# EAGLE board CFT-PB0-revB (EAGLE 5.11)
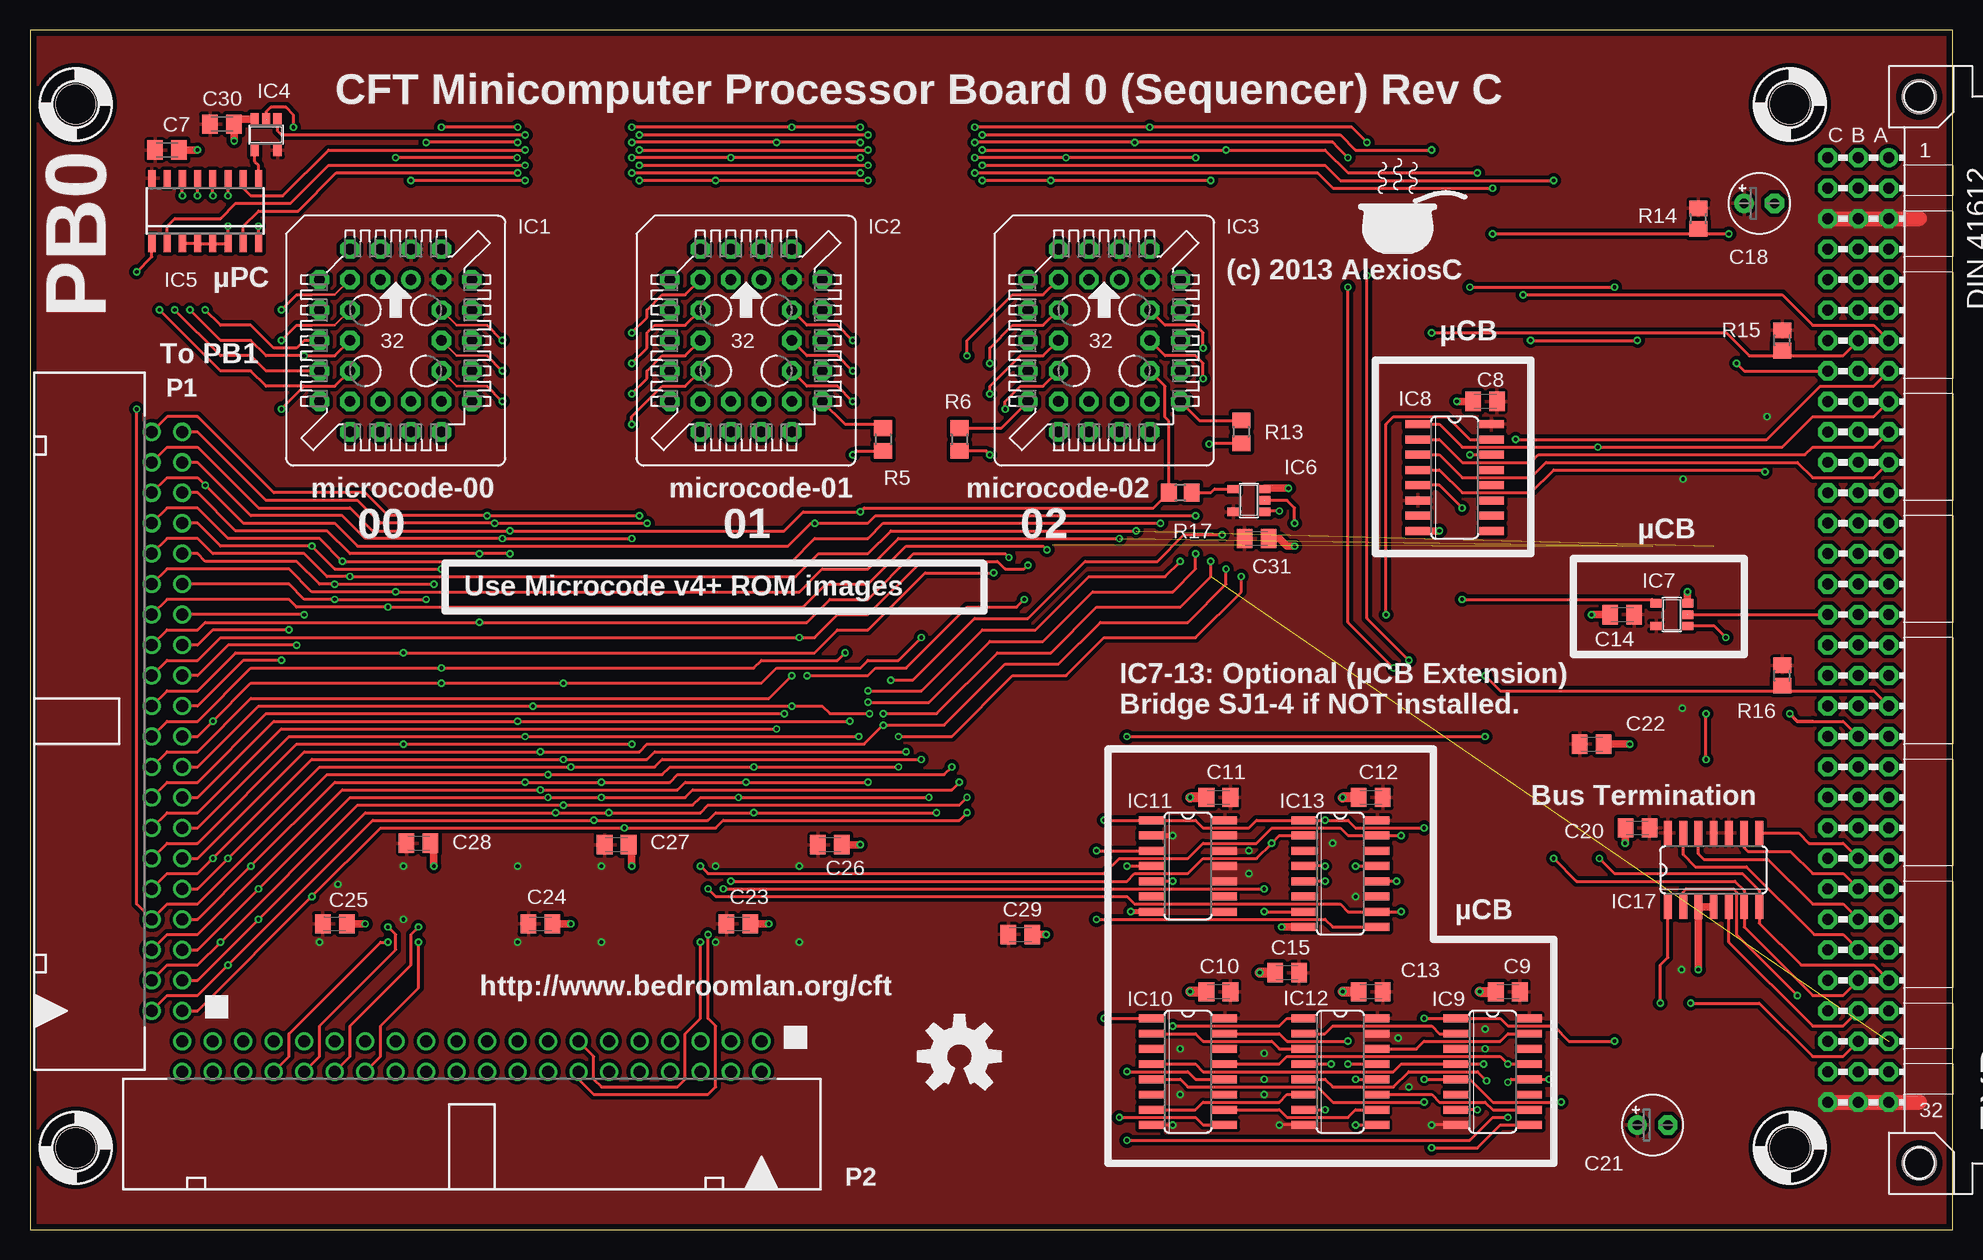
[diagram p4: board, top side]
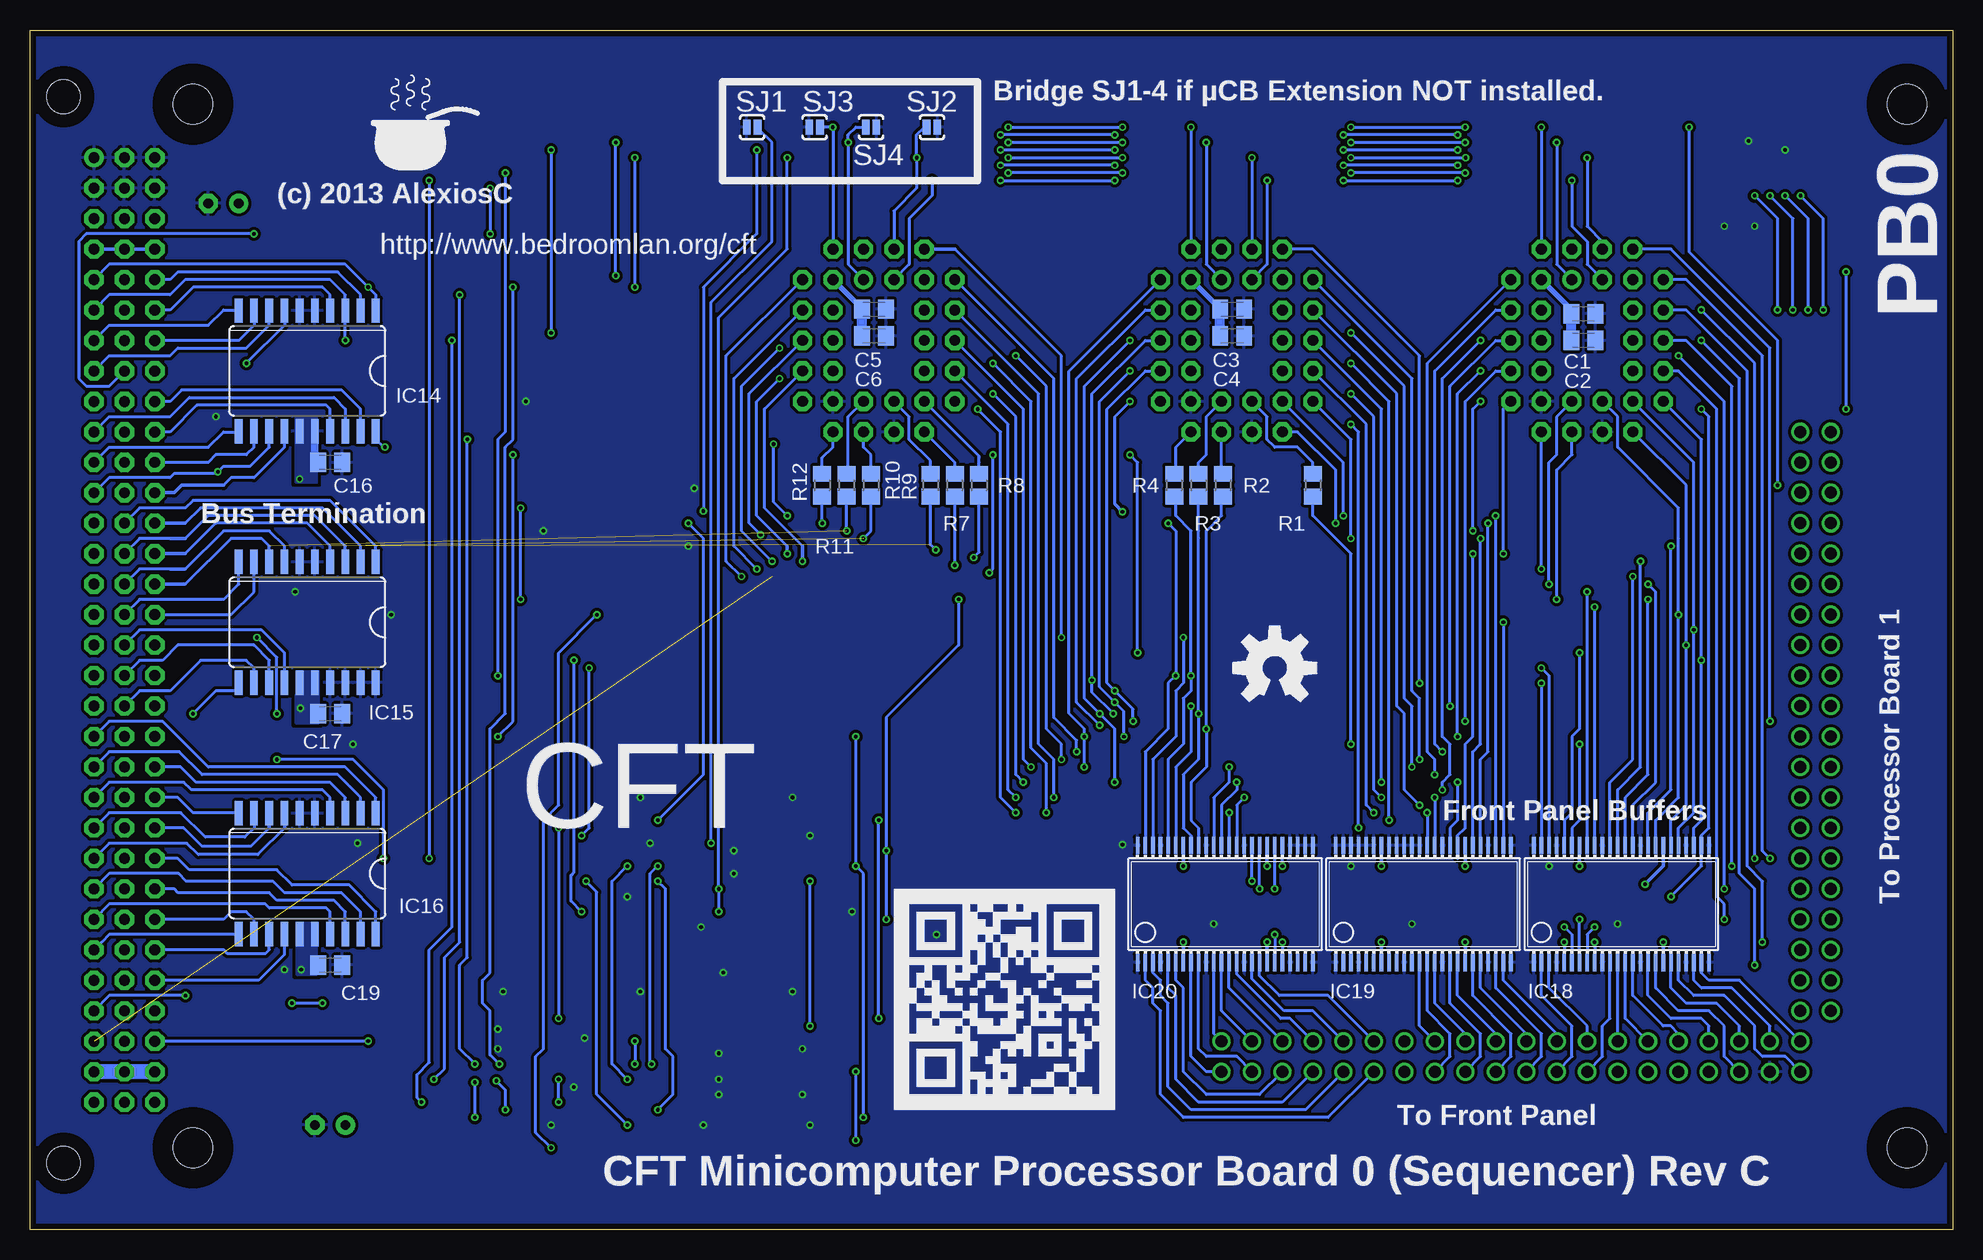
[diagram p5: board, bottom side, seen from below]

Size 160.27 x 100.03 mm. Coordinates in mm from the lower left corner, seen from the top.
Copper layers (1*16): Top 0.035mm / dielectric 1.5mm / Bottom 0.035mm
Design rules "smart-prototyping *": minimum track width 7mil, minimum drill 12mil, track to track 7mil, track to pad 7mil, pad to pad 7mil, via to via 7mil, smd to smd 0mil, copper to edge 20mil, drill to drill 10mil, minimum pad ring 10mil, minimum via ring 6mil, stop-mask expansion 2mil, vias tented up to drill 25mil, thermal gap 10mil
Net classes: 0 default: width 0.203 mm, clearance 0.152 mm; 1 low power: width 0.203 mm, clearance 0.152 mm; 2 LED power: width 1.93 mm, clearance 0.152 mm

## Footprints (pad centres in the part's own frame; a part is rotated, then mirrored left to right if it is on the bottom)
C0805K = smd 1.3 x 1.6: 1 -1,0; 2 1,0
E2,5-5 = drill 0.813 pad 1.6 round: + -1.27,0 | drill 0.813 pad 1.6 octagon: - 1.27,0
VG96K = drill 0.914 pad 1.6 round: A1 154.94,39.37 | drill 0.914 pad 1.6 octagon: A2 154.94,36.83; A3 154.94,34.29; A4 154.94,31.75; A5 154.94,29.21; A6 154.94,26.67; A7 154.94,24.13; A8 154.94,21.59; A9 154.94,19.05; A10 154.94,16.51; A11 154.94,13.97; A12 154.94,11.43; A13 154.94,8.89; A14 154.94,6.35; A15 154.94,3.81; A16 154.94,1.27; A17 154.94,-1.27; A18 154.94,-3.81; A19 154.94,-6.35; A20 154.94,-8.89; A21 154.94,-11.43; A22 154.94,-13.97; A23 154.94,-16.51; A24 154.94,-19.05; A25 154.94,-21.59; A26 154.94,-24.13; A27 154.94,-26.67; A28 154.94,-29.21; A29 154.94,-31.75; A30 154.94,-34.29; A31 154.94,-36.83; A32 154.94,-39.37; B1 152.4,39.37; B2 152.4,36.83; B3 152.4,34.29; B4 152.4,31.75; B5 152.4,29.21; B6 152.4,26.67; B7 152.4,24.13; B8 152.4,21.59; B9 152.4,19.05; B10 152.4,16.51; B11 152.4,13.97; B12 152.4,11.43; B13 152.4,8.89; B14 152.4,6.35; B15 152.4,3.81; B16 152.4,1.27; B17 152.4,-1.27; B18 152.4,-3.81; B19 152.4,-6.35; B20 152.4,-8.89; B21 152.4,-11.43; B22 152.4,-13.97; B23 152.4,-16.51; B24 152.4,-19.05; B25 152.4,-21.59; B26 152.4,-24.13; B27 152.4,-26.67; B28 152.4,-29.21; B29 152.4,-31.75; B30 152.4,-34.29; B31 152.4,-36.83; B32 152.4,-39.37; C1 149.86,39.37; C2 149.86,36.83; C3 149.86,34.29; C4 149.86,31.75; C5 149.86,29.21; C6 149.86,26.67; C7 149.86,24.13; C8 149.86,21.59; C9 149.86,19.05; C10 149.86,16.51; C11 149.86,13.97; C12 149.86,11.43; C13 149.86,8.89; C14 149.86,6.35; C15 149.86,3.81; C16 149.86,1.27; C17 149.86,-1.27; C18 149.86,-3.81; C19 149.86,-6.35; C20 149.86,-8.89; C21 149.86,-11.43; C22 149.86,-13.97; C23 149.86,-16.51; C24 149.86,-19.05; C25 149.86,-21.59; C26 149.86,-24.13; C27 149.86,-26.67; C28 149.86,-29.21; C29 149.86,-31.75; C30 149.86,-34.29; C31 149.86,-36.83; C32 149.86,-39.37 | hole 2.794: 157.48,44.45; 157.48,-44.45
PLCC32 = drill 0.9 pad 1.6 round: 1 1.27,5.08 | drill 0.9 pad 1.6 octagon: 2 -1.27,7.62; 3 -1.27,5.08; 4 -3.81,7.62; 5 -6.35,5.08; 6 -3.81,5.08; 7 -6.35,2.54; 8 -3.81,2.54; 9 -6.35,0; 10 -3.81,0; 11 -6.35,-2.54; 12 -3.81,-2.54; 13 -6.35,-5.08; 14 -3.81,-7.62; 15 -3.81,-5.08; 16 -1.27,-7.62; 17 -1.27,-5.08; 18 1.27,-7.62; 19 1.27,-5.08; 20 3.81,-7.62; 21 6.35,-5.08; 22 3.81,-5.08; 23 6.35,-2.54; 24 3.81,-2.54; 25 6.35,0; 26 3.81,0; 27 6.35,2.54; 28 3.81,2.54; 29 6.35,5.08; 30 3.81,7.62; 31 3.81,5.08; 32 1.27,7.62
SOT23-5 = smd 0.69 x 0.99: 1 -0.95,-1.29; 2 0,-1.29; 3 0.95,-1.29; 4 0.95,1.3; 5 -0.95,1.3
SO16D = smd 0.6 x 1.4: 1 -4.445,-2.715; 2 -3.175,-2.715; 3 -1.905,-2.715; 4 -0.635,-2.715; 5 0.635,-2.715; 6 1.905,-2.715; 7 3.175,-2.715; 8 4.445,-2.715; 9 4.445,2.715; 10 3.175,2.715; 11 1.905,2.715; 12 0.635,2.715; 13 -0.635,2.715; 14 -1.905,2.715; 15 -3.175,2.715; 16 -4.445,2.715
SO16 = smd 0.66 x 2.032: 1 -4.445,-3.073; 2 -3.175,-3.073; 3 -1.905,-3.073; 4 -0.635,-3.073; 5 0.635,-3.073; 6 1.905,-3.073; 7 3.175,-3.073; 8 4.445,-3.073; 9 4.445,3.073; 10 3.175,3.073; 11 1.905,3.073; 12 0.635,3.073; 13 -0.635,3.073; 14 -1.905,3.073; 15 -3.175,3.073; 16 -4.445,3.073
SO14 = smd 0.66 x 2.032: 1 -3.81,-3.073; 2 -2.54,-3.073; 3 -1.27,-3.073; 4 0,-3.073; 5 1.27,-3.073; 6 2.54,-3.073; 7 3.81,-3.073; 8 3.81,3.073; 9 2.54,3.073; 10 1.27,3.073; 11 0,3.073; 12 -1.27,3.073; 13 -2.54,3.073; 14 -3.81,3.073
SO20W = smd 0.66 x 2.032: 1 -5.715,-5.029; 2 -4.445,-5.029; 3 -3.175,-5.029; 4 -1.905,-5.029; 5 -0.635,-5.029; 6 0.635,-5.029; 7 1.905,-5.029; 8 3.175,-5.029; 9 4.445,-5.029; 10 5.715,-5.029; 11 5.715,5.029; 12 4.445,5.029; 13 3.175,5.029; 14 1.905,5.029; 15 0.635,5.029; 16 -0.635,5.029; 17 -1.905,5.029; 18 -3.175,5.029; 19 -4.445,5.029; 20 -5.715,5.029
SSOP48DL = smd 0.305 x 1.422: 1 -6.985,-4.877; 2 -6.35,-4.877; 3 -5.715,-4.877; 4 -5.08,-4.877; 5 -4.445,-4.877; 6 -3.81,-4.877; 7 -3.175,-4.877; 8 -2.54,-4.877; 9 -1.905,-4.877; 10 -1.27,-4.877; 11 -0.635,-4.877; 12 0,-4.877; 13 0.635,-4.877; 14 1.27,-4.877; 15 1.905,-4.877; 16 2.54,-4.877; 17 3.175,-4.877; 18 3.81,-4.877; 19 4.445,-4.877; 20 5.08,-4.877; 21 5.715,-4.877; 22 6.35,-4.877; 23 6.985,-4.877; 24 7.62,-4.877; 25 7.62,4.877; 26 6.985,4.877; 27 6.35,4.877; 28 5.715,4.877; 29 5.08,4.877; 30 4.445,4.877; 31 3.81,4.877; 32 3.175,4.877; 33 2.54,4.877; 34 1.905,4.877; 35 1.27,4.877; 36 0.635,4.877; 37 0,4.877; 38 -0.635,4.877; 39 -1.27,4.877; 40 -1.905,4.877; 41 -2.54,4.877; 42 -3.175,4.877; 43 -3.81,4.877; 44 -4.445,4.877; 45 -5.08,4.877; 46 -5.715,4.877; 47 -6.35,4.877; 48 -6.985,4.877
PAK100/2500-5-40 = drill 1 pad 1.422 round: 1 -24.13,-1.27; 2 -24.13,1.27; 3 -21.59,-1.27; 4 -21.59,1.27; 5 -19.05,-1.27; 6 -19.05,1.27; 7 -16.51,-1.27; 8 -16.51,1.27; 9 -13.97,-1.27; 10 -13.97,1.27; 11 -11.43,-1.27; 12 -11.43,1.27; 13 -8.89,-1.27; 14 -8.89,1.27; 15 -6.35,-1.27; 16 -6.35,1.27; 17 -3.81,-1.27; 18 -3.81,1.27; 19 -1.27,-1.27; 20 -1.27,1.27; 21 1.27,-1.27; 22 1.27,1.27; 23 3.81,-1.27; 24 3.81,1.27; 25 6.35,-1.27; 26 6.35,1.27; 27 8.89,-1.27; 28 8.89,1.27; 29 11.43,-1.27; 30 11.43,1.27; 31 13.97,-1.27; 32 13.97,1.27; 33 16.51,-1.27; 34 16.51,1.27; 35 19.05,-1.27; 36 19.05,1.27; 37 21.59,-1.27; 38 21.59,1.27; 39 24.13,-1.27; 40 24.13,1.27
R0805 = smd 1.3 x 1.5: 1 -0.95,0; 2 0.95,0
R0805' = smd 1.3 x 1.5: 1 -0.85,0; 2 0.85,0
SJ_2S-NO = smd 0.635 x 1.27: 1 -0.45,0; 2 0.45,0
STANDOFF_28_60 = hole 3.302: 0,0

## Placement (x,y rotation side)
$4_37_$  SIGNATURESILK  [SIGNATURE]  131.44,88.11 0 bottom
$4_39_$  OSHW-LOGOL  [OSHW-LOGO-L]  56.52,46.84 0 bottom
$4_40_$  QRCODE-CFT  [CFT-QRCODE]  88.27,10.01 0 bottom
C1  0.1uF  [C0805K]  30.8,76.37 0 bottom
C2  1uF  [C0805K]  30.8,74.14 0 bottom
C3  0.1uF  [C0805K]  60.07,76.75 0 bottom
C4  1uF  [C0805K]  60.07,74.52 0 bottom
C5  0.1uF  [C0805K]  89.92,76.75 0 bottom
C6  1uF  [C0805K]  89.92,74.52 0 bottom
C7  0.1uF  [C0805K]  11.43,90.02 0 top
C8  0.1uF  [C0805K]  121.28,69.06 180 top
C9  0.1uF  [C0805K]  123.19,19.85 180 top
C10  0.1uF  [C0805K]  99.06,19.85 180 top
C11  0.1uF  [C0805K]  99.06,36.04 180 top
C12  0.1uF  [C0805K]  111.76,36.04 180 top
C13  0.1uF  [C0805K]  111.76,19.85 180 top
C14  0.1uF  [C0805K]  132.72,51.28 180 top
C15  1uF  [C0805K]  104.78,21.44 180 top
C16  0.1uF  [C0805K]  135.25,63.98 0 bottom
C17  0.1uF  [C0805K]  135.25,43.03 0 bottom
C18  47uF  [E2,5-5]  144.15,85.57 0 top
C19  0.1uF  [C0805K]  135.25,22.07 0 bottom
C20  0.1uF  [C0805K]  133.99,33.5 180 top
C21  47uF  [E2,5-5]  135.25,8.74 0 top
C22  1uF  [C0805K]  130.18,40.49 0 top
C23  0.1uF  [C0805K]  59.05,25.5 0 top
C24  0.1uF  [C0805K]  42.55,25.5 0 top
C25  0.1uF  [C0805K]  25.4,25.5 0 top
C26  0.1uF  [C0805K]  66.67,32.11 0 top
C27  0.1uF  [C0805K]  48.9,32.11 0 top
C28  0.1uF  [C0805K]  32.38,32.23 0 top
C29  1uF  [C0805K]  82.55,24.61 0 top
C30  0.1uF  [C0805K]  16,92.18 0 top
C31  0.1uF  [C0805K]  102.23,57.63 0 top
EXP  [VG96K]  0,50.01 0 top
IC1  29F040  [PLCC32]  30.48,74.14 0 top
IC2  29F040  [PLCC32]  59.69,74.14 0 top
IC3  29F040  [PLCC32]  89.53,74.14 0 top
IC4  74AHC1G08DBV  [SOT23-5]  19.68,91.29 180 top
IC5  74HC161D  [SO16D]  14.61,84.94 0 top
IC6  74AHC1G00DBV  [SOT23-5]  101.6,60.81 90 top
IC7  74AHC1G32DBV  [SOT23-5]  136.84,51.28 90 top
IC8  74HC138D  [SO16]  118.75,62.71 270 top
IC9  74HC175D  [SO16]  121.92,13.18 270 top
IC10  74HC175D  [SO16]  96.52,13.18 270 top
IC11  74HC74D  [SO14]  96.52,30.33 270 top
IC12  74HC157D  [SO16]  109.22,13.18 270 top
IC13  74HC175D  [SO16]  109.22,29.69 270 top
IC14  SN74ACT1073  [SO20W]  137.16,71.6 180 bottom
IC15  SN74ACT1073  [SO20W]  137.16,50.65 180 bottom
IC16  SN74ACT1073  [SO20W]  137.16,29.69 180 bottom
IC17  SN74ACT1071D  [SO14]  140.34,30.01 0 top
IC18  74AC16244DL  [SSOP48DL]  27.94,27.15 0 bottom
IC19  74AC16244DL  [SSOP48DL]  44.45,27.15 0 bottom
IC20  74AC16244DL  [SSOP48DL]  60.96,27.15 0 bottom
P1  2540-5  [PAK100/2500-5-40]  11.43,42.39 90 top
P2  2540-5  [PAK100/2500-5-40]  36.83,14.45 180 top
R1  30R  [R0805]  53.34,62.08 270 bottom
R2  30R  [R0805]  60.83,62.08 270 bottom
R3  30R  [R0805]  62.87,62.08 270 bottom
R4  30R  [R0805]  64.9,62.08 270 bottom
R5  30R  [R0805]  71.12,65.89 270 top
R6  30R  [R0805]  77.47,65.89 270 top
R7  30R  [R0805]  83.19,62.08 270 bottom
R8  30R  [R0805]  81.15,62.08 270 bottom
R9  30R  [R0805]  85.22,62.08 270 bottom
R10  30R  [R0805]  90.17,62.08 270 bottom
R11  30R  [R0805]  92.2,62.08 270 bottom
R12  30R  [R0805]  94.23,62.08 270 bottom
R13  30R  [R0805]  100.97,66.52 270 top
R14  4k7  [R0805']  139.06,84.3 90 top
R15  4k7  [R0805']  146.05,74.14 90 top
R16  4k7  [R0805']  146.05,46.2 90 top
R17  30R  [R0805]  95.89,61.44 180 top
SJ1  SOLDERJUMPER-OLDNO  [SJ_2S-NO]  100.08,91.92 0 bottom
SJ2  SOLDERJUMPER-OLDNO  [SJ_2S-NO]  85.09,91.92 180 bottom
SJ3  SOLDERJUMPER-OLDNO  [SJ_2S-NO]  94.87,91.92 0 bottom
SJ4  SOLDERJUMPER-OLDNO  [SJ_2S-NO]  90.17,91.92 180 bottom
U1  HOLE  [STANDOFF_28_60]  3.81,93.83 0 top
U2  HOLE  [STANDOFF_28_60]  3.81,6.83 0 top
U3  HOLE  [STANDOFF_28_60]  146.69,93.83 0 top
U4  HOLE  [STANDOFF_28_60]  146.69,6.83 0 top
U$1  SIGNATURESILK  [SIGNATURE]  111.12,81.13 0 top
U$3  OSHW-LOGOL  [OSHW-LOGO-L]  77.47,14.45 0 top

## Tracks (layer width: path | path; a pad name or v marks a point on that pad's centre or on a via)
!AINDEX  (via drill 0.3)
  Top 0.203: 23.5,75.41 25.4,75.41 IC1.8
  Top 0.254: v20.95,74.14 22.23,75.41 23.5,75.41 | P1.2 11.43,19.53 13.97,19.53 v16.51,22.07 28.57,34.14 v46.99,34.14 56.52,34.14 57.15,34.77 v60.33,34.77 v75.56,34.77 | IC2.8 54.61,75.41 52.07,75.41 51.44,74.78 51.44,73.51 v50.16,72.24 | IC3.8 84.45,75.41 81.92,75.41 80.01,73.51 v80.01,72.24
  Bottom 0.254: v50.16,72.24 46.99,69.06 v46.99,34.14 | v16.51,22.07 16.51,28.42 17.78,29.69 17.78,70.97 v20.95,74.14 | v80.01,72.24 76.83,69.06 76.83,40.17 75.56,38.9 v75.56,34.77 | v60.33,34.77 IC20.36
!CLI  (via drill 0.3)
  Top 0.254: P1.18 11.43,39.85 13.97,39.85 18.41,44.3 61.59,44.3 v63.5,46.2
  Bottom 0.254: IC20.44 65.41,39.22 64.14,40.49 64.14,44.3 63.5,44.93 v63.5,46.2 63.5,58.27 64.77,59.54 64.77,61 R4.2
!CLL  (via drill 0.3)
  Top 0.254: P1.14 11.43,34.77 13.97,34.77 20.95,41.76 v62.23,41.76
  Bottom 0.254: IC20.40 62.87,33.5 63.5,34.14 63.5,37.31 62.23,38.58 v62.23,41.76 62.23,58.27 60.96,59.54 60.96,61 R2.2
!CPL  (via drill 0.3)
  Top 0.254: P1.12 11.43,32.23 13.97,32.23 22.23,40.49 v31.11,40.49 v50.16,40.49
  Bottom 0.254: v50.16,40.49 50.16,56.36 53.34,59.54 R1.2 | v31.11,40.49 31.11,34.14 31.75,33.5 IC18.43
!DEC  (via drill 0.3)
  Top 0.254: v81.6,56.04 81.28,56.36 73.66,56.36 69.85,52.55 66.67,52.55 64.77,50.65 v37.47,50.65 14.61,50.65 13.97,50.01 11.43,50.01 P1.26
  Bottom 0.254: v37.47,50.65 IC19.26 | R8.2 81.15,56.49 v81.6,56.04
!END  (via drill 0.3)
  Top 0.254: v97.16,59.54 70.48,59.54 69.85,58.9 v65.41,58.9 65.09,58.9 63.18,57 27.3,57 25.4,58.9 17.78,58.9 v14.61,62.08 13.97,62.71 11.43,62.71 P1.36 | v82.87,52.55 82.23,51.92 78.11,51.92 73.03,46.84 70.48,46.84 69.85,46.2 v64.77,46.2 | IC13.9 108.58,25.25 107.95,25.88 v88.9,25.88 | v88.9,31.6 IC11.3 | R13.2 98.36,65.57 v98.3,65.51 | v21.97,91.92 21.97,92.94 21.34,93.57 20.07,93.57 19.68,93.19 IC4.2
  Bottom 0.254: v65.41,58.9 64.77,58.27 v64.77,46.2 65.41,45.57 65.41,41.76 67.31,39.85 IC20.47 | v82.87,52.55 82.87,48.74 88.9,42.71 v88.9,31.6 v88.9,25.88 | v98.3,65.51 98.3,60.68 v97.16,59.54 | v14.61,62.08 14.61,74.14 21.97,81.51 v21.97,91.92
!ENDEXT  (via drill 0.3)
  Top 0.254: v116.84,90.02 110.49,90.02 109.22,91.29 v79.38,91.29 | v116.84,74.78 141.39,74.78 143.29,72.87 146.05,72.87 R15.1 146.47,72.87 151.13,72.87 EXP.B7 | v50.8,91.29 v69.85,91.29 | v41.27,91.29 20.95,91.29 20.64,91.61 IC4.1
  Bottom 0.254: v116.84,90.02 v116.84,74.78 | v69.85,91.29 v79.38,91.29 | v41.27,91.29 v50.8,91.29
!HALT  (via drill 0.3)
  Top 0.254: EXP.A19 153.67,44.93 146.47,44.93 R16.1 arc-90 145.63,44.93 122.56,44.93 v121.28,46.2 | v120.65,88.11 109.86,88.11 107.95,90.02 v99.69,90.02 v79.38,90.02 | v50.8,90.02 v69.85,90.02 | v41.27,90.02 24.89,90.02 21.08,86.21 18.41,86.21 17.78,86.84 IC5.10 | IC6.1 102.95,59.92 v104.14,59.92
  Bottom 0.254: v120.65,88.11 120.65,66.52 121.28,65.89 v121.28,46.2 | v99.69,90.02 99.69,83.03 104.14,78.59 v104.14,59.92 | v69.85,90.02 v79.38,90.02 | v41.27,90.02 v50.8,90.02
!INCPC  (via drill 0.3)
  Top 0.254: P1.20 11.43,42.39 13.97,42.39 18.41,46.84 v34.29,46.84 60.33,46.84 60.96,47.47 67.31,47.47 v67.94,48.11 | R5.2 68.9,64.94 v68.58,64.62
  Bottom 0.254: v34.29,46.84 33.66,46.2 IC18.46 | v67.94,48.11 67.94,63.98 v68.58,64.62
!IO  (via drill 0.3)  (1 unrouted)
  Top 0.254: v90.81,57.63 72.39,57.63 69.85,55.09 66.04,55.09 64.14,53.19 v30.48,53.19 23.5,53.19 21.59,55.09 11.43,55.09 P1.30
  Bottom 0.254: 147.32,56.36 144.78,58.9 137.16,58.9 135.25,57 IC15.4 | IC18.41 v30.48,53.19 | R10.2 90.17,58.27 v90.81,57.63
  Bottom 0.305: 147.32,56.36 EXP.C14
!IODEV1XX
  Top 0.254: EXP.B24 151.13,32.23 148.27,32.23 147.42,33.08 IC17.8
!IODEV2XX
  Top 0.254: EXP.B25 151.13,29.69 148.59,29.69 146.75,31.53 143.19,31.53 142.88,31.85 IC17.9
!IODEV3XX
  Top 0.254: EXP.B26 151.13,27.15 148.59,27.15 144.84,30.9 139.51,30.9 139.06,31.34 IC17.12
!IRQS  (via drill 0.3)  (1 unrouted)
  Top 0.203: 38.1,75.41 35.56,75.41 IC1.28
  Top 0.254: v39.37,74.14 38.1,75.41 | v98.42,55.73 98.42,54.46 95.89,51.92 88.9,51.92 85.09,48.11 80.64,48.11 75.56,43.03 v71.12,43.03 | P1.6 11.43,24.61 13.97,24.61 26.04,36.68 v42.55,36.68 53.98,36.68 54.61,37.31 v59.69,37.31 v69.85,37.31 | IC2.28 64.77,75.41 67.31,75.41 v68.58,74.14 | IC3.28 94.61,75.41 97.16,75.41 97.79,74.78 v97.79,73.51
  Bottom 0.254: v97.79,73.51 100.97,70.33 100.97,58.27 v98.42,55.73 | v39.37,74.14 42.55,70.97 42.55,41.12 41.91,40.49 41.91,37.95 42.55,37.31 v42.55,36.68 | v68.58,74.14 72.39,70.33 72.39,44.3 v71.12,43.03 69.85,41.76 v69.85,37.31 | v59.69,37.31 59.69,36.68 60.96,35.41 IC20.37
!MEM  (via drill 0.3)  (1 unrouted)
  Top 0.254: v84.77,56.68 84.45,57 73.03,57 69.85,53.82 66.36,53.82 64.45,51.92 v29.84,51.92 22.23,51.92 21.59,52.55 11.43,52.55 P1.28
  Bottom 0.254: 147.32,58.9 146.05,60.17 135.89,60.17 132.72,57 IC15.2 | IC18.40 v29.84,51.92 | R9.2 85.22,57.12 v84.77,56.68
  Bottom 0.305: 147.32,58.9 EXP.C13
!R  (via drill 0.3)  (1 unrouted)
  Top 0.254: v92.2,58.27 71.75,58.27 69.85,56.36 65.72,56.36 63.82,54.46 v26.67,54.46 24.77,54.46 22.86,56.36 15.24,56.36 13.97,57.63 11.43,57.63 P1.32
  Bottom 0.254: 147.32,53.82 143.51,57.63 140.97,57.63 140.34,57 IC15.8 | IC18.38 28.57,37.31 26.67,39.22 v26.67,54.46 | v92.2,58.27 R11.2
  Bottom 0.305: 147.32,53.82 EXP.C15
!RESET  (via drill 0.3)
  Top 0.254: v89.53,17.63 IC10.1 | v89.53,34.14 IC11.1 97.16,34.14 97.79,33.5 101.6,33.5 102.23,34.14 IC13.1 v107.95,34.14 109.86,34.14 110.49,33.5 v116.2,33.5 | v116.2,17.63 IC9.1 122.56,17.63 123.19,16.99 127,16.99 128.27,15.72 v132.08,15.72 | IC6.2 104.78,60.81 105.41,60.17 v105.41,58.9
  Bottom 0.254: v89.53,17.63 v89.53,34.14 | v116.2,33.5 v116.2,17.63 | v105.41,58.9 104.14,57.63 104.14,37.95 v107.95,34.14 | v132.08,15.72 EXP.C30
!RSTHOLD  (via drill 0.3)
  Top 0.254: v100.97,54.46 100.97,53.19 97.16,49.38 89.53,49.38 86.36,46.2 81.92,46.2 76.83,41.12 v72.39,41.12 | v72.39,38.58 v60.33,38.58 53.34,38.58 52.7,37.95 v43.18,37.95 24.77,37.95 13.97,27.15 11.43,27.15 P1.8 8.89,27.15 v8.89,68.43 | v8.89,79.86 10.16,81.13 IC5.1
  Bottom 0.254: IC3.29 102.23,72.87 102.23,55.73 v100.97,54.46 | IC1.29 43.81,72.24 43.81,39.85 43.18,39.22 v43.18,37.95 | IC2.29 73.66,71.6 73.66,43.03 72.39,41.76 v72.39,41.12 v72.39,38.58 | IC20.38 61.59,36.04 60.33,37.31 v60.33,38.58 | v8.89,68.43 v8.89,79.86
!SETUCBP  (via drill 0.3)
  Top 0.254: v116.84,6.83 120.65,6.83 122.56,8.74 IC9.9 | IC8.15 120.02,65.89 118.11,67.79 113.67,67.79 113.03,67.16 v113.03,51.28
  Bottom 0.254: v116.84,6.83 118.11,8.1 118.11,14.45 117.47,15.09 117.47,34.14 116.2,35.41 116.2,48.11 v113.03,51.28
!SETUCBT  (via drill 0.3)
  Top 0.254: IC10.9 97.79,8.74 97.16,9.37 v90.81,9.37 | v91.44,30.33 IC11.4 | v91.44,41.12 v121.28,41.12 | v120.02,64.62 IC8.14
  Bottom 0.254: v90.81,9.37 90.81,29.69 v91.44,30.33 v91.44,41.12 | v121.28,41.12 120.02,42.39 v120.02,64.62
!SKIP  (via drill 0.3)
  Top 0.254: P1.4 11.43,22.07 13.97,22.07 v15.88,23.98 27.3,35.41 v44.45,35.41 55.24,35.41 55.88,36.04 v59.05,36.04 v74.93,36.04
  Bottom 0.254: v15.88,23.98 15.88,29.06 17.14,30.33 17.14,71.6 22.23,76.68 IC1.7 | IC2.7 46.35,69.7 46.35,43.66 45.72,43.03 45.72,36.68 v44.45,35.41 | IC3.7 76.2,69.7 76.2,40.49 74.93,39.22 v74.93,36.04 | v59.05,36.04 59.69,35.41 IC20.35
!STI  (via drill 0.3)
  Top 0.254: P1.16 11.43,37.31 13.97,37.31 19.68,43.03 v62.87,43.03
  Bottom 0.254: IC20.41 63.5,32.87 64.14,33.5 64.14,37.95 62.87,39.22 v62.87,43.03 62.87,57.63 62.87,58.27 R3.2
!STPAC  (via drill 0.3)
  Top 0.254: v83.19,55.41 82.87,55.09 81.28,55.09 80.64,55.73 74.3,55.73 69.85,51.28 67.31,51.28 65.41,49.38 v64.14,49.38 15.88,49.38 13.97,47.47 11.43,47.47 P1.24
  Bottom 0.254: v64.14,49.38 64.14,45.57 64.77,44.93 64.77,41.12 66.67,39.22 IC20.46 | v83.19,55.41 R7.2
!STPDR  (via drill 0.3)
  Top 0.254: v80.33,54.77 74.61,54.77 69.85,50.01 67.31,50.01 65.41,48.11 v31.11,48.11 17.14,48.11 13.97,44.93 11.43,44.93 P1.22 | R6.2 79.69,64.94 v80.01,64.62
  Bottom 0.254: v80.01,64.62 80.01,55.09 v80.33,54.77 | v31.11,48.11 31.11,41.76 31.75,41.12 31.75,34.77 32.38,34.14 IC18.44
!SYSDEV  (via drill 0.3)
  Top 0.254: EXP.A28 153.67,22.07 147.64,22.07 144.15,25.56 IC17.7 144.15,28.3 142.75,29.69 132.08,29.69 v130.81,30.96 | IC7.1 140.4,50.33 v141.35,49.38 | v139.7,39.22 v139.7,43.03
  Bottom 0.254: v130.81,30.96 130.81,36.68 133.35,39.22 v139.7,39.22 | v141.35,49.38 139.7,47.73 v139.7,43.03
!T34
  Top 0.254: EXP.B27 151.13,24.61 148.72,24.61 143.06,30.26 138.81,30.26 137.79,31.28 IC17.13
!UCBA!/UCBB  (via drill 0.3)
  Top 0.254: IC12.1 104.78,17.63 104.14,16.99 v95.25,16.99 | v95.25,29.06 IC11.5
  Bottom 0.254: v95.25,16.99 v95.25,29.06
!UCE  (via drill 0.3)
  Top 0.203: 38.1,70.33 35.56,70.33 IC1.24
  Top 0.254: v39.37,69.06 38.1,70.33 | IC2.24 64.77,70.33 67.31,70.33 v68.58,69.06 | IC3.24 94.61,70.33 94.61,67.73 94.94,67.41 R17.2 93.67,60.17 69.53,60.17 v69.22,59.86 64.45,59.86 62.87,58.27 v40.01,58.27 28.57,58.27 26.67,60.17 19.05,60.17 13.97,65.25 11.43,65.25 P1.38
  Bottom 0.254: v68.58,69.06 69.85,67.79 69.85,60.49 | v39.37,69.06 40.01,68.43 v40.01,58.27
  Bottom 0.305: v69.22,59.86 69.85,60.49
!UPCCLR
  Top 0.254: IC4.4 18.73,89.06 19.05,88.75 IC5.9
!W
  Top 0.254: IC7.2 EXP.C16
  Bottom 0.254: EXP.C16 143.51,51.28 141.6,53.19 IC15.9
!WEN  (via drill 0.3)
  Top 0.254: v94.23,58.9 71.12,58.9 69.85,57.63 65.41,57.63 63.5,55.73 v26.04,55.73 24.13,57.63 16.51,57.63 13.97,60.17 11.43,60.17 P1.34
  Bottom 0.254: IC18.37 27.94,36.68 26.04,38.58 v26.04,55.73 | v94.23,58.9 R12.2
!WS  (via drill 0.3)
  Top 0.254: IC5.7 17.78,83.67 19.05,84.94 22.35,84.94 25.53,88.11 v40.64,88.11 | v141.6,83.03 139.49,83.03 R14.1 138.65,83.03 v121.92,83.03 | v50.16,88.11 v69.22,88.11 | v78.74,88.11 107.31,88.11 108.58,86.84 v121.92,86.84
  Bottom 0.254: EXP.B8 153.67,70.33 155.57,70.33 156.21,70.97 156.21,82.4 155.57,83.03 v141.6,83.03 | v40.64,88.11 v50.16,88.11 | v69.22,88.11 v78.74,88.11 | v121.92,86.84 v121.92,83.03
+3.3V
  Bottom 0.305: EXP.C4 EXP.B4 EXP.A4
+12V
  Bottom 1.27: EXP.C31 EXP.B31 EXP.A31
AB0  (via drill 0.3)
  Top 0.254: IC10.4 97.16,13.82 97.79,13.18 113.67,13.18 114.3,13.82 IC9.4 v121.16,13.82 | v120.02,78.59 v132.08,78.59
  Bottom 0.254: EXP.A5 153.67,80.49 133.99,80.49 v132.08,78.59 131.44,77.95 IC14.1 | v121.16,13.82 121.92,14.58 121.92,18.26 122.56,18.9 122.56,20.8 121.92,21.44 121.92,41.76 120.65,43.03 120.65,65.25 120.02,65.89 v120.02,78.59
AB1  (via drill 0.3)
  Top 0.254: IC10.5 95.89,12.55 96.52,11.91 107.31,11.91 108.58,10.64 v116.2,10.64 | v116.2,12.55 IC9.5 120.02,12.55 121.92,10.64 v127.64,10.64 | v125.09,74.14 v133.99,74.14
  Bottom 0.254: EXP.A6 153.67,77.95 148.59,77.95 147.32,79.22 135.25,79.22 133.99,77.95 IC14.3 v133.99,74.14 | v116.2,10.64 v116.2,12.55 | v125.09,74.14 125.09,25.25 127,23.34 127,13.94 128.02,12.93 128.02,11.02 v127.64,10.64
AB2  (via drill 0.3)
  Top 0.254: IC10.12 97.16,12.55 96.52,13.18 v91.44,13.18 | v91.44,7.47 120.02,7.47 121.92,9.37 v123.19,9.37 | v123.19,12.29 123.44,12.55 IC9.12 v126.62,12.55 | EXP.A7 153.67,75.41 148.59,75.41 146.05,77.95 v124.46,77.95
  Bottom 0.254: v91.44,7.47 v91.44,13.18 | v123.19,9.37 v123.19,12.29 | EXP.A7 153.67,75.41 145.41,75.41 144.15,76.68 142.93,76.68 IC14.10 | v124.46,77.95 124.46,23.98 125.73,22.71 125.73,13.44 v126.62,12.55
AB3  (via drill 0.3)
  Top 0.254: IC10.13 104.14,13.82 104.78,14.45 122.56,14.45 v123.19,13.82 IC9.13 | v123.83,65.89 144.78,65.89 149.22,70.33 153.67,70.33 EXP.A8
  Bottom 0.254: EXP.A8 153.67,72.87 148.59,72.87 147.96,73.51 142.24,73.51 140.34,75.41 IC14.8 | v123.19,13.82 124.46,15.09 124.46,22.07 123.83,22.71 v123.83,65.89
AB4  (via drill 0.3)
  Top 0.254: IC8.1 117.47,67.16 119.38,65.25 v130.68,65.25 146.05,65.25 148.59,67.79 153.67,67.79 EXP.A9
  Bottom 0.254: IC14.20 131.44,65.89 130.81,65.25 v130.68,65.25
AB5
  Top 0.254: IC8.2 117.47,65.89 119.38,63.98 125.09,63.98 125.73,64.62 147.96,64.62 148.59,65.25 153.67,65.25 EXP.A10
  Bottom 0.254: EXP.A10 153.67,67.79 148.59,67.79 147,69.38 134.94,69.38 133.99,68.43 IC14.18
AB6
  Top 0.254: IC8.3 117.47,64.62 119.38,62.71 125.09,62.71 126.36,63.98 147.32,63.98 148.59,62.71 153.67,62.71 EXP.A11
  Bottom 0.203: EXP.A11 154.31,64.62
  Bottom 0.254: 154.31,64.62 153.67,65.25 145.41,65.25 144.15,66.52 142.93,66.52
  Bottom 0.305: 142.93,66.52 IC14.11
AB7  (via drill 0.3)
  Top 0.254: IC8.4 117.47,63.35 119.38,61.44 125.09,61.44 127,63.35 144.46,63.35 v144.62,63.19
  Bottom 0.254: EXP.A12 153.67,62.71 148.59,62.71 148.27,63.03 144.78,63.03 v144.62,63.19 144.15,63.66 141.92,63.66 140.34,65.25 IC14.13
AB8
  Bottom 0.254: EXP.A20 153.67,42.39 149.22,42.39 145.41,38.58 133.99,38.58 131.44,36.04 IC16.1
AB9
  Bottom 0.254: EXP.A21 153.67,39.85 147.83,39.85 145.92,37.95 134.62,37.95 132.72,36.04 IC16.2
AB10
  Bottom 0.254: EXP.A22 153.67,37.31 147.45,37.31 146.81,36.68 135.89,36.68 135.25,36.04 IC16.4
AB11
  Bottom 0.254: EXP.A23 153.67,34.77 147.7,34.77 145.67,32.74 142.37,32.74 141.6,33.5 IC16.9
AB12
  Bottom 0.254: EXP.A24 153.67,32.23 147.19,32.23 146.24,31.28 141.29,31.28 139.06,33.5
  Bottom 0.305: IC16.7 139.06,33.5
AB13
  Bottom 0.254: IC16.19 132.72,26.52 134.3,28.1 139.06,28.1 140.02,29.06 147.26,29.06 147.89,29.69 153.67,29.69 EXP.A25
AB14
  Bottom 0.254: EXP.A26 153.67,27.15 140.65,27.15 140.34,26.83 135.57,26.83 135.25,26.52 IC16.17
AB15
  Bottom 0.203: 154.31,23.98 EXP.A27
  Bottom 0.254: 154.31,23.98 153.67,24.61 142.93,24.61 IC16.11
AEXT0
  Bottom 0.254: EXP.B13 151.13,60.17 148.59,60.17 147.32,60.17 146.69,60.81 135.25,60.81 131.44,57 IC15.1
AEXT1
  Bottom 0.254: 148.59,57.63 151.13,57.63 EXP.B14 | 147.32,57.63 145.41,59.54 136.53,59.54 133.99,57 IC15.3
  Bottom 0.305: 147.32,57.63 148.59,57.63
AEXT2
  Bottom 0.254: 148.59,55.09 151.13,55.09 EXP.B15 | 147.32,55.09 144.15,58.27 140.34,58.27 139.06,57 IC15.7
  Bottom 0.305: 147.32,55.09 148.59,55.09
AEXT3
  Bottom 0.254: EXP.B16 151.13,52.55 148.59,52.55 144.15,52.55 142.88,53.82 IC15.10
AEXT4
  Bottom 0.254: EXP.B17 151.13,50.01 148.59,50.01 140.97,50.01 139.06,48.11 IC15.14
AEXT5
  Bottom 0.254: EXP.B18 151.13,47.47 149.22,47.47 147.96,48.74 141.6,48.74 140.34,47.47 IC15.13
AEXT6
  Bottom 0.254: EXP.B19 151.13,44.93 148.91,44.93 148.59,44.93 146.05,47.47 142.24,47.47 141.6,46.84 IC15.12
AEXT7  (via drill 0.3)
  Top 0.254: EXP.B20 151.13,42.39 148.59,42.39
  Top 0.305: v146.69,43.03 147.32,42.39 148.59,42.39
  Bottom 0.254: v146.69,43.03 144.78,44.93 142.88,44.93
  Bottom 0.305: IC15.11 142.88,44.93
CLK1  (via drill 0.3)
  Top 0.254: IC17.2 137.79,28.17 138.05,28.42 141.99,28.42 142.24,28.17 142.24,24.61 v147.32,19.53
  Bottom 0.254: v147.32,19.53 153.67,19.53 EXP.A29
CLK2
  Top 0.254: IC17.5 141.6,23.98 148.59,16.99 151.13,16.99 EXP.B29
CLK3  (via drill 0.3)
  Top 0.254: v135.89,18.9 135.89,22.07 136.53,22.71 IC17.1 | EXP.B30 151.13,14.45 148.59,14.45 144.15,18.9 v138.43,18.9
  Bottom 0.254: v135.89,18.9 v138.43,18.9
CLK4  (via drill 0.3)
  Top 0.254: EXP.B28 151.13,19.53 148.59,19.53 142.88,25.25 IC17.6 142.88,28.3 142.11,29.06 128.91,29.06 v127,30.96 | v79.38,88.75 107.95,88.75 109.22,87.48 v127,87.48 | v50.8,88.75 v69.85,88.75 | IC5.2 11.43,83.67 12.06,84.3 15.88,84.3 17.14,85.57 21.72,85.57 24.89,88.75 v41.27,88.75
  Bottom 0.254: v69.85,88.75 v79.38,88.75 | v41.27,88.75 v50.8,88.75 | v127,87.48 v127,30.96
DB0
  Bottom 0.254: EXP.C5 148.59,79.22 147.96,79.86 134.62,79.86 132.72,77.95 IC14.2
DB1
  Bottom 0.254: EXP.C6 148.59,76.68 146.69,78.59 135.89,78.59 135.25,77.95 IC14.4
DB2
  Bottom 0.254: EXP.C7 142.88,74.14 141.6,75.41 IC14.9
DB3  (via drill 0.3)
  Top 0.254: v142.24,72.24 142.88,71.6 EXP.C8
  Bottom 0.254: v142.24,72.24 139.06,75.41 IC14.7
DB4
  Bottom 0.254: IC14.19 132.72,68.43 134.3,70.01 147.64,70.01 148.59,69.06 EXP.C9
DB5
  Bottom 0.254: EXP.C10 148.59,66.52 146.37,68.75 135.57,68.75 135.25,68.43 IC14.17
DB6
  Bottom 0.254: EXP.C11 145.41,63.98 144.78,64.62 142.24,64.62 141.6,65.25 IC14.12
DB7
  Bottom 0.254: 144.15,62.08 143.51,62.71 141.6,62.71 139.06,65.25 IC14.14
  Bottom 0.305: 144.15,62.08 147.64,62.08 148.27,61.44 EXP.C12
DB8
  Bottom 0.254: EXP.C21 147.7,38.58 146.43,37.31 135.25,37.31 133.99,36.04 IC16.3
DB9
  Bottom 0.254: EXP.C22 147.96,36.04 146.69,34.77 142.93,34.77 IC16.10
DB10
  Bottom 0.254: EXP.C23 147.45,33.5 145.92,31.98 141.86,31.98 140.34,33.5
  Bottom 0.305: 140.34,33.5 IC16.8
DB11
  Bottom 0.254: EXP.C24 147.96,30.96 147,30.01 139.7,30.01 138.43,28.74 133.67,28.74 131.44,26.52 IC16.20
DB12
  Bottom 0.254: EXP.C25 148.27,28.42 147.96,28.1 140.34,28.1 139.7,27.47 134.94,27.47 133.99,26.52 IC16.18
DB13
  Bottom 0.254: EXP.C26 144.15,25.88 143.51,26.52 142.24,26.52 141.6,25.88 IC16.12
DB14
  Bottom 0.254: EXP.C27 144.15,23.34 143.83,23.03 140.65,23.03 140.34,23.34 IC16.13
DB15
  Bottom 0.254: IC16.14 139.06,22.96 141.22,20.8 EXP.C28
FL  (via drill 0.3)
  Top 0.254: v99.38,57.95 96.2,57.95 93.98,55.73 87.95,55.73 83.19,50.97 78.74,50.97 73.6,45.82 v71.75,45.82 | P1.17 13.97,38.58 19.05,43.66 v41.91,43.66 v63.5,43.66 66.04,43.66 66.67,43.03 v69.98,43.03
  Bottom 0.254: IC3.25 100.33,69.7 100.33,58.9 v99.38,57.95 | IC1.25 38.1,74.14 41.91,70.33 v41.91,43.66 | IC2.25 67.31,74.14 71.75,69.7 v71.75,45.82 71.75,44.81 v69.98,43.03 | v63.5,43.66 63.5,39.85 64.77,38.58 IC20.43
FV  (via drill 0.3)
  Top 0.254: P1.19 13.97,41.12 v15.24,42.39 18.41,45.57 v34.29,45.57 v44.45,45.57 60.96,45.57 62.23,46.84 69.22,46.84 69.85,47.47 72.39,47.47 v74.3,49.38
  Bottom 0.254: v74.3,49.38 74.3,72.87 83.19,81.76 | IC2.4 53.34,81.76 44.45,72.87 v44.45,45.57 | IC1.4 23.5,81.76 15.24,73.51 v15.24,42.39 | v34.29,45.57 IC18.47
  Bottom 0.305: 83.19,81.76 IC3.4
GND  (via drill 0.3)
  Top 0.254: v104.33,25.25 104.33,25.18 | IC10.8 v95.25,8.74 | IC12.8 v104.14,8.74 | IC9.8 v116.84,8.74 | 33.66,32.5 C28.2 | IC5.3 IC5.4 IC5.5 IC5.6 v16.51,83.67 | IC5.8 v19.05,83.67 | IC6.3 102.96,61.82
  Top 0.406: IC11.7 v91.76,26.52 | IC11.2 v95.25,32.87
  Top 0.61: v118.94,69.06 C8.2 | IC17.4 IC17.3 v139.06,21.69 | IC8.8 v117.47,58.27 | IC7.3 138.13,53.14 v138.18,53.19 | C14.2 v130.18,51.28 | C25.2 v27.94,25.5 | v33.66,30.33 33.66,32.5 | C24.2 v45.09,25.5 | C23.2 v61.59,25.5 | C26.2 v69.22,32.11 | C27.2 50.16,31.84 v50.16,30.33 | C22.2 v133.35,40.49 | C29.2 v84.71,24.61 | C7.2 v13.97,90.02 | C31.2 104.14,57.63 104.78,57 v105.41,57 | 102.96,61.82 v104.9,61.82 | IC13.8 v104.33,25.25 | v17.02,90.78 17.02,92.16 C30.2 17.4,92.58 IC4.3 | C20.2 132.97,33.49 v132.97,32.23
  Top 0.813: C11.2 v96.71,36.04 | C12.2 v109.41,36.04 | v120.84,19.85 C9.2 | C10.2 v96.71,19.85 | C13.2 v109.41,19.85 | C15.2 v102.49,21.44
  other vias: 114.05,15.98 101.6,29.69 101.6,31.6 108.58,32.23 110.49,27.79 95.89,15.09 102.87,14.71 102.87,12.55 102.87,11.28 95.89,11.28 114.94,11.91 121.28,16.74 121.28,15.09
  pour Bottom (isolate 0.254, rank 6): 0,100.05 160.02,100.05 160.02,0.48 0,0.48
  pour Top (isolate 0.254, no thermals): 94.49,34.14 94.49,25.88 111.12,25.88 111.12,34.14 104.78,34.14 104.14,33.5 97.79,33.5 97.16,34.14
  pour Top (isolate 0.254, no thermals): 94.61,16.36 94.61,8.1 123.83,8.1 123.83,16.99 123.19,16.99 122.56,17.63 118.75,17.63 117.47,16.36 104.78,16.36 104.14,15.72 97.79,15.72 97.16,16.36
IR11  (via drill 0.3)
  Top 0.203: 23.5,77.95 25.4,77.95 IC1.6
  Top 0.254: v20.95,76.68 22.23,77.95 23.5,77.95 | P1.9 13.97,28.42 v16.51,30.96 24.13,38.58 v45.09,38.58 52.07,38.58 52.7,39.22 v74.3,39.22 | IC2.6 54.61,77.95 52.7,77.95 51.44,76.68 51.44,76.05 v50.16,74.78 | IC3.6 84.45,77.95 81.92,77.95 78.11,74.14 v78.11,72.87
  Bottom 0.254: v20.95,76.68 16.51,72.24 v16.51,30.96 | v50.16,74.78 45.72,70.33 45.72,44.3 45.09,43.66 v45.09,38.58 | v78.11,72.87 75.56,70.33 75.56,41.76 74.3,40.49 v74.3,39.22
IR12  (via drill 0.3)
  Top 0.254: P1.10 11.43,29.69 13.97,29.69 v15.24,30.96 23.5,39.22 v44.45,39.22 51.44,39.22 52.07,39.85 v73.03,39.85
  Bottom 0.254: IC3.5 74.93,70.97 74.93,42.71 73.03,40.8 v73.03,39.85 | IC2.5 45.09,70.97 45.09,44.93 44.45,44.3 v44.45,39.22 | IC1.5 22.23,79.22 15.88,72.87 15.88,31.6 v15.24,30.96
IR13  (via drill 0.3)
  Top 0.254: v99.69,55.09 99.69,53.82 96.52,50.65 89.22,50.65 85.72,47.15 81.28,47.15 76.2,42.08 v71.12,42.08 69.53,40.49 51.44,40.49 50.8,39.85 v42.55,39.85 22.86,39.85 13.97,30.96 P1.11
  Bottom 0.254: IC3.27 101.6,70.97 101.6,57 v99.69,55.09 | v71.12,42.08 73.03,43.98 73.03,70.97 67.31,76.68 IC2.27 | IC1.27 38.1,76.68 43.18,71.6 43.18,40.49 v42.55,39.85
IR14  (via drill 0.3)
  Top 0.203: 38.1,72.87 35.56,72.87 IC1.26
  Top 0.254: v39.37,71.6 38.1,72.87 | v97.16,56.36 97.16,55.09 95.25,53.19 88.58,53.19 84.45,49.06 80.01,49.06 74.93,43.98 v69.85,43.98 | P1.13 13.97,33.5 21.59,41.12 v41.27,41.12 v69.09,41.12 | IC2.26 64.77,72.87 67.31,72.87 v68.58,71.6 | IC3.26 94.61,72.87 97.16,72.87 97.79,72.24 v97.79,70.97
  Bottom 0.254: v97.79,70.97 99.69,69.06 99.69,59.54 97.16,57 | v41.27,41.12 41.27,69.7 v39.37,71.6 | v68.58,71.6 71.12,69.06 71.12,45.25 v69.85,43.98 69.09,43.22 v69.09,41.12
  Bottom 0.305: v97.16,56.36 97.16,57
IR15  (via drill 0.3)
  Top 0.254: v95.89,55.73 94.61,54.46 88.27,54.46 83.82,50.01 79.38,50.01 74.3,44.93 v69.85,44.93 | P1.15 13.97,36.04 20.32,42.39 v40.64,42.39 v68.33,42.39
  Bottom 0.254: IC3.23 99.06,68.43 99.06,60.17 95.89,57 | IC1.23 38.1,71.6 40.64,69.06 v40.64,42.39 | IC2.23 67.31,71.6 70.48,68.43 70.48,45.57 v69.85,44.93 68.33,43.41 v68.33,42.39
  Bottom 0.305: v95.89,55.73 95.89,57
N$1  (via drill 0.3)
  Top 0.254: IC8.5 117.47,62.08 v119.38,60.17 | v119.38,52.55 135.22,52.55 IC7.4
  Bottom 0.254: v119.38,52.55 v119.38,60.17
N$2  (via drill 0.3)
  Top 0.254: v107.95,30.33 IC13.4 | IC12.4 v108.46,13.82
  Bottom 0.254: v108.46,13.82 108.58,13.82 108.58,29.69 v107.95,30.33
N$3  (via drill 0.3)
  Top 0.254: IC12.7 v107.95,10.01 | v107.95,29.06 IC13.5
  Bottom 0.254: v107.95,10.01 106.68,11.28 106.68,14.45 107.31,15.09 107.31,28.42 v107.95,29.06
N$4  (via drill 0.3)
  Top 0.254: v113.92,29.06 IC13.12 | v110.49,8.74 IC12.9
  Bottom 0.254: v110.49,8.74 113.03,11.28 113.03,28.17 v113.92,29.06
N$5  (via drill 0.3)
  Top 0.254: v110.49,30.33 IC13.13 | v110.49,12.55 IC12.12
  Bottom 0.254: v110.49,12.55 111.76,13.82 111.76,29.06 v110.49,30.33
N$6
  Bottom 0.254: IC18.23 20.95,21.44 20.32,20.8 17.78,20.8 P2.39
N$7
  Bottom 0.254: IC18.22 21.59,20.8 20.95,20.17 18.41,20.17 15.24,16.99 P2.37
N$8
  Bottom 0.254: IC18.20 22.86,20.8 21.59,19.53 19.05,19.53 16.51,16.99 16.51,15.09 15.88,14.45 13.97,14.45 P2.40
N$9
  Bottom 0.254: IC18.19 23.5,20.17 22.23,18.9 19.68,18.9 17.78,16.99 P2.35
N$10
  Bottom 0.254: IC20.2 67.31,20.8 66.67,20.17 66.67,18.9 66.04,18.26 66.04,11.28 64.14,9.37 52.07,9.37 P2.12
N$11
  Bottom 0.254: IC20.3 66.67,21.44 66.04,20.8 66.04,19.53 65.41,18.9 65.41,11.91 63.5,10.01 53.98,10.01 P2.10
N$12
  Bottom 0.254: IC20.9 62.87,15.09 62.23,14.45 59.69,14.45 P2.4
N$13
  Bottom 0.254: IC20.8 63.5,14.45 62.23,13.18 P2.2
N$14
  Bottom 0.254: IC20.6 64.77,20.8 64.14,20.17 64.14,13.18 62.23,11.28 57.78,11.28 P2.6
N$15
  Bottom 0.254: IC20.5 65.41,20.17 64.77,19.53 64.77,12.55 62.87,10.64 55.88,10.64 P2.8
N$16
  Bottom 0.254: IC20.11 61.59,16.36 P2.1
N$17
  Bottom 0.254: IC20.12 60.96,18.26 P2.3
N$18
  Bottom 0.254: IC20.13 60.33,20.17 P2.5
N$19
  Bottom 0.254: P2.7 55.24,17.63 56.01,17.63 59.69,21.31 IC20.14
N$20
  Bottom 0.254: IC20.16 58.42,20.93 55.75,18.26 53.34,18.26 P2.9
N$21
  Bottom 0.254: IC20.17 57.78,21.18 56.13,19.53 52.07,19.53 P2.11
N$22  (via drill 0.3)
  Top 0.254: v55.88,23.98 55.88,17.63 54.61,16.36 54.61,12.55 53.98,11.91 47.62,11.91 46.99,12.55 46.99,14.45 P2.13
  Bottom 0.254: v55.88,23.98 IC20.20
N$23  (via drill 0.3)
  Top 0.254: v56.52,24.61 56.52,17.63 57.15,16.99 57.15,11.91 56.52,11.28 46.99,11.28 45.72,12.55 P2.14
  Bottom 0.254: v56.52,24.61 IC20.19
N$24
  Bottom 0.254: IC18.17 24.77,20.17 22.86,18.26 20.32,18.26 19.05,16.99 19.05,14.45 P2.36
N$25
  Bottom 0.254: IC18.16 25.4,19.53 23.5,17.63 20.95,17.63 20.32,16.99 P2.33
N$26
  Bottom 0.254: IC18.14 26.67,19.53 24.13,16.99 23.5,16.99 22.86,16.36 P2.31
N$27
  Bottom 0.254: IC18.13 27.3,17.63 P2.29
N$28
  Bottom 0.254: P2.27 IC18.12
N$29
  Bottom 0.254: IC18.11 28.57,17.63 29.21,16.99 29.21,14.45 P2.26
N$30  (via drill 0.3)
  Top 0.254: P2.34 21.59,14.45 21.59,16.36 29.21,23.98 v29.84,23.98
  Bottom 0.254: v29.84,23.98 IC18.9
N$31  (via drill 0.3)
  Top 0.254: v29.84,25.25 30.48,24.61 30.48,23.34 24.13,16.99 24.13,14.45 P2.32
  Bottom 0.254: v29.84,25.25 30.48,24.61 IC18.8
N$32  (via drill 0.3)
  Top 0.254: v32.38,25.25 31.75,24.61 31.75,22.07 26.67,16.99 26.67,14.45 P2.30
  Bottom 0.254: v32.38,25.25 31.75,24.61 IC18.6
N$33  (via drill 0.3)
  Top 0.254: v32.38,23.98 32.38,20.17 29.21,16.99 29.21,14.45 P2.28
  Bottom 0.254: v32.38,23.98 IC18.5
N$34
  Bottom 0.254: IC18.3 33.66,20.17 30.48,16.99 P2.25
N$35
  Bottom 0.254: IC18.2 34.29,19.53 31.75,16.99 31.75,14.45 P2.24
N$36
  Bottom 0.254: IC19.23 37.47,20.8 33.02,16.36 P2.23
N$37
  Bottom 0.254: P2.22 34.29,14.45 34.29,16.36 38.1,20.17 IC19.22
N$38
  Bottom 0.254: IC19.20 39.37,20.17 35.56,16.36 P2.21
N$39
  Bottom 0.254: IC19.19 40.01,19.53 36.83,16.36 36.83,14.45 P2.20
N$40
  Bottom 0.254: IC19.17 41.27,19.53 38.1,16.36 P2.19
N$41
  Bottom 0.254: IC19.16 41.91,18.9 39.37,16.36 39.37,14.45 P2.18
N$42
  Bottom 0.254: IC19.14 43.18,18.9 40.64,16.36 P2.17
N$43
  Bottom 0.254: IC19.13 43.81,18.26 41.91,16.36 41.91,14.45 P2.16
N$44
  Bottom 0.254: IC19.12 44.45,16.99 P2.15
N$45
  Top 0.254: R17.1 98.42,61.44 98.74,61.76 IC6.4
N$56
  Bottom 0.254: IC2.17 57.15,67.79 57.15,65.89 56.52,65.25 54.61,65.25 53.34,63.98 R1.1
N$57
  Bottom 0.254: IC2.18 60.96,63.15 R2.1
N$58
  Bottom 0.254: IC2.19 62.23,67.79 62.23,64.62 62.87,63.98 R3.1
N$59
  Bottom 0.254: IC2.20 64.77,65.25 64.77,63.15 R4.1
N$60
  Top 0.254: IC2.21 67.94,67.16 70.8,67.16 R5.1
N$61
  Top 0.254: R6.1 80.96,66.84 IC3.13
N$62
  Bottom 0.254: IC3.14 83.19,63.98 R7.1
N$63
  Bottom 0.254: R8.1 81.15,63.98 81.15,64.36 81.15,64.49 IC3.15
N$64
  Bottom 0.254: IC3.17 87,67.79 87,65.89 85.22,64.11 R9.1
N$65
  Bottom 0.254: IC3.18 90.81,65.25 90.17,64.62 R10.1
N$66
  Bottom 0.254: IC3.19 92.08,67.79 92.08,63.35 92.2,63.22 R11.1
N$67
  Bottom 0.254: IC3.20 93.34,65.25 94.23,64.36 R12.1
N$68
  Top 0.254: IC3.21 97.47,67.47 R13.1
OPIF0  (via drill 0.3)
  Top 0.254: P1.35 13.97,61.44 17.14,58.27 24.77,58.27 26.67,56.36 v37.47,56.36 v40.01,56.36
  Bottom 0.254: v37.47,56.36 37.47,68.43 IC1.21 | 41.27,30.96 IC19.32 41.27,32.87 40.64,33.5 40.64,40.49 40.01,41.12 v40.01,56.36
OPIF1  (via drill 0.3)
  Top 0.254: P1.37 13.97,63.98 18.41,59.54 26.04,59.54 27.94,57.63 v39.37,57.63 v50.16,57.63
  Bottom 0.254: v50.16,57.63 50.16,65.89 IC2.13 | v39.37,57.63 39.37,40.49 40.01,39.85 IC19.30
OPIF2  (via drill 0.3)
  Top 0.254: P1.39 13.97,66.52 19.68,60.81 27.3,60.81 29.21,58.9 v38.73,58.9 v51.44,58.9
  Bottom 0.254: v51.44,58.9 51.44,63.35 54.61,66.52 55.24,66.52 IC2.14 | v38.73,58.9 38.73,39.85 39.37,39.22 IC19.29
OPIF3  (via drill 0.3)
  Top 0.254: P1.40 11.43,67.79 13.97,67.79 20.32,61.44 27.94,61.44 29.84,59.54 v38.1,59.54 v50.8,59.54
  Bottom 0.254: IC19.27 v38.1,59.54 | IC2.15 50.8,63.98 v50.8,59.54
RUNIT0  (via drill 0.3)
  Top 0.254: P1.21 13.97,43.66 17.78,47.47 v20.95,47.47
  Bottom 0.254: IC18.27 21.59,33.5 20.95,34.14 v20.95,47.47 20.95,65.89 IC1.13
RUNIT1  (via drill 0.3)
  Top 0.254: P1.23 13.97,46.2 16.51,48.74 v22.23,48.74
  Bottom 0.254: IC18.30 23.5,34.14 22.23,35.41 v22.23,48.74 22.23,62.08 IC1.14
RUNIT2  (via drill 0.3)
  Top 0.254: P1.25 13.97,48.74 15.24,50.01 v21.59,50.01
  Bottom 0.254: IC18.29 22.86,33.5 21.59,34.77 v21.59,50.01 21.59,63.98 IC1.15
RUNIT3  (via drill 0.3)
  Top 0.254: v22.86,51.28 P1.27
  Bottom 0.254: 22.86,57.63 v22.86,51.28 22.86,36.04 24.77,34.14 IC18.32 | 22.86,57.63 | 22.86,57.63 22.86,60.17 27.94,65.25 27.94,67.79 IC1.17
UCB0  (via drill 0.3)
  Top 0.254: v58.42,29.06 91.44,29.06 92.08,29.69 96.52,29.69 97.79,30.96 102.23,30.96 v103.5,32.23 104.14,32.87 IC13.2 | v41.27,87.48 v31.75,87.48 | v50.8,87.48 v57.15,87.48 v69.85,87.48 | v79.38,87.48 v85.09,87.48 v98.42,87.48
  Bottom 0.254: IC3.3 87,80.49 87,84.3 85.09,86.21 v85.09,87.48 | v58.42,29.06 IC20.33 | v103.5,32.23 103.5,77.32 98.42,82.4 v98.42,87.48 98.42,90.65 99.63,91.85 SJ1.2 | IC2.3 57.15,80.49 v57.15,87.48 | IC1.3 30.48,80.49 30.48,82.4 31.75,83.67 v31.75,87.48 | v50.8,87.48 v41.27,87.48 | v79.38,87.48 v69.85,87.48
UCB1  (via drill 0.3)
  Top 0.254: v40.61,89.38 v30.48,89.38 | v50.16,89.38 v58.42,89.38 v69.22,89.38 | v78.74,89.38 v86.36,89.38 v97.16,89.38 | v57.78,28.42 v102.87,28.42 | v102.87,26.52 IC13.7
  Bottom 0.254: IC3.2 88.27,84.94 86.36,86.84 v86.36,89.38 86.36,91.29 85.72,91.92 SJ2.2 | v50.16,89.38 v40.61,89.38 | v78.74,89.38 v69.22,89.38 | v97.16,89.38 97.16,81.76 102.87,76.05 v102.87,28.42 v102.87,26.52 | 29.21,82.4 30.48,83.67 v30.48,89.38 | v57.78,28.42 IC20.32 | v58.42,89.38 IC2.2
  Bottom 0.305: 29.21,82.4 IC1.2
UCB2  (via drill 0.3)
  Top 0.254: v56.52,28.42 57.15,27.79 91.44,27.79 92.08,27.15 109.22,27.15 109.86,26.52 IC13.10 v114.3,26.52 | v111.44,79.54 111.44,50.97 v114.94,47.47 | v111.44,90.65 110.17,91.92 v93.34,91.92 v78.74,91.92 | v69.22,91.92 v63.5,91.92 v50.16,91.92 | v40.64,91.92 v34.29,91.92
  Bottom 0.254: v111.44,79.54 v111.44,90.65 | v56.52,28.42 IC20.30 | v114.94,47.47 114.94,29.82 115.19,29.57 115.19,27.41 v114.3,26.52 | v78.74,91.92 v69.22,91.92 | v63.5,91.92 IC2.30 | v34.29,91.92 IC1.30 | v50.16,91.92 v40.64,91.92 | IC3.30 v93.34,91.92 SJ3.2
UCB3  (via drill 0.3)
  Top 0.254: v109.86,89.38 109.06,90.18 108.58,90.65 v92.08,90.65 v78.74,90.65 | v109.86,78.59 109.86,50.65 v113.67,46.84 | v55.88,30.33 56.52,29.69 89.53,29.69 90.81,30.96 96.52,30.96 97.79,32.23 102.23,32.23 103.5,33.5 109.22,33.5 109.86,32.87 IC13.15 v114.3,32.87 | v40.64,90.65 v33.02,90.65 | v50.16,90.65 v62.23,90.65 v69.22,90.65
  Bottom 0.254: IC3.1 92.08,80.49 v92.08,90.65 92.08,91.29 91.44,91.92 SJ4.2 | v109.86,78.59 v109.86,89.38 | v55.88,30.33 IC20.29 | v114.3,32.87 113.67,33.5 v113.67,46.84 | IC2.1 62.23,80.49 v62.23,90.65 | IC1.1 33.02,80.49 v33.02,90.65 | v50.16,90.65 v40.64,90.65 | v78.74,90.65 v69.22,90.65
UCBA0
  Top 0.254: IC12.2 107.95,16.36 108.58,16.99 116.84,16.99 117.47,16.36 IC9.2
UCBA1  (via drill 0.3)
  Top 0.254: v121.41,12.42 120.65,13.18 114.94,13.18 113.67,11.91 108.58,11.91 107.95,12.55 IC12.5 | v120.65,10.01 IC9.7
  Bottom 0.254: v121.41,12.42 120.65,11.66 v120.65,10.01
UCBA2
  Top 0.254: IC9.10 121.92,10.01 121.28,10.64 117.47,10.64 116.84,11.28 IC12.11
UCBA3
  Top 0.254: IC12.14 115.57,15.09 116.2,15.72 122.56,15.72 123.19,16.36 IC9.15
UCBB0
  Top 0.254: IC10.2 97.16,16.36 97.79,15.72 103.5,15.72 104.14,15.09 IC12.3
UCBB1
  Top 0.254: IC10.7 97.16,10.01 97.79,10.64 104.14,10.64 104.78,11.28 IC12.6
UCBB2
  Top 0.254: IC10.10 104.14,10.01 104.78,9.37 109.86,9.37 110.49,10.01 IC12.10
UCBB3  (via drill 0.3)
  Top 0.254: IC10.15 104.14,16.36 104.78,15.72 v109.86,15.72 | v109.86,13.82 IC12.13
  Bottom 0.254: v109.86,15.72 v109.86,13.82
UPC0  (via drill 0.3)
  Top 0.254: P1.1 13.97,18.26 v23.5,27.79 29.21,33.5 v49.53,33.5 57.15,33.5 57.78,34.14 77.47,34.14 v78.11,34.77 | v50.16,67.16 50.16,67.79 52.7,70.33 54.61,70.33 IC2.12 | IC3.12 84.45,70.33 82.55,70.33 81.28,69.06 v81.28,68.43 | 22.86,70.33 19.68,70.33 18.41,71.6 15.88,71.6 v10.79,76.68 | v20.95,68.43 22.86,70.33 | 22.86,70.33 25.4,70.33 IC1.12 | v12.7,86.21 IC5.14
  Bottom 0.254: v50.16,67.16 49.53,66.52 v49.53,33.5 | v81.28,68.43 79.38,66.52 79.38,36.04 v78.11,34.77 | v20.95,68.43 20.32,67.79 20.32,33.5 20.95,32.87 IC18.26 20.95,30.33 v23.5,27.79 | v10.79,76.68 10.79,84.3 v12.7,86.21
UPC1  (via drill 0.3)
  Top 0.254: P1.3 13.97,20.8 v19.05,25.88 27.94,34.77 v43.81,34.77 v48.26,34.77 55.88,34.77 56.52,35.41 77.47,35.41 v78.11,36.04 | IC1.11 19.68,71.6 18.41,72.87 15.88,72.87 v12.06,76.68 | v13.97,86.21 IC5.13
  Bottom 0.254: IC3.11 78.74,67.16 78.74,36.68 v78.11,36.04 | IC2.11 48.9,67.16 48.9,35.41 v48.26,34.77 | IC1.11 22.86,71.6 19.68,68.43 19.68,27.79 19.05,27.15 v19.05,25.88 | v43.81,34.77 IC19.36 | v12.06,76.68 12.06,84.3 v13.97,86.21
UPC2  (via drill 0.3)
  Top 0.254: P1.5 13.97,23.34 v19.05,28.42 26.67,36.04 v43.18,36.04 v47.62,36.04 54.61,36.04 55.24,36.68 76.83,36.68 v77.47,37.31 | IC2.10 54.61,72.87 52.7,72.87 51.44,71.6 51.44,70.97 v50.16,69.7 | IC3.10 84.45,72.87 82.55,72.87 80.01,70.33 v80.01,69.7 | IC1.10 25.4,72.87 v22.86,72.87 19.68,72.87 18.41,74.14 15.88,74.14 v13.34,76.68 | v15.24,86.21 IC5.12
  Bottom 0.254: v22.86,72.87 19.05,69.06 v19.05,28.42 | v50.16,69.7 48.26,67.79 48.26,36.68 v47.62,36.04 | v80.01,69.7 78.11,67.79 78.11,37.95 v77.47,37.31 | 43.18,31.6 IC19.35 v43.18,36.04 | v13.34,76.68 13.34,84.3 v15.24,86.21
UPC3  (via drill 0.3)
  Top 0.254: P1.7 13.97,25.88 v18.41,30.33 25.4,37.31 v41.27,37.31 v47.62,37.31 53.34,37.31 53.98,37.95 76.2,37.95 v76.83,38.58 | v14.61,76.68 15.88,75.41 18.41,75.41 20.32,73.51 22.23,73.51 22.86,74.14 IC1.9 | v16.51,86.21 IC5.11
  Bottom 0.254: IC1.9 22.23,74.14 18.41,70.33 v18.41,30.33 | IC2.9 47.62,68.43 v47.62,37.31 | v76.83,38.58 77.47,39.22 77.47,68.43 IC3.9 | v41.27,37.31 41.27,34.14 41.91,33.5 IC19.33 | v14.61,76.68 14.61,84.3 v16.51,86.21
VCC  (via drill 0.3)
  Top 1.27: EXP.C3 EXP.B3 EXP.A3 157.48,84.3 | EXP.A32 EXP.B32 EXP.C32 157.48,10.64
  Bottom 0.254: IC18.7 v31.11,25.88 | C3.1 61.01,76.68 60.96,76.68
  Bottom 0.305: IC18.18 v24.13,23.98 | IC20.18 v57.15,23.98 | IC20.7 v64.14,23.98 | v31.11,30.33 IC18.42 | v25.65,28.8 24.13,30.33 IC18.31 | v57.15,30.33 IC20.31 | v64.14,30.33 IC20.42 | v40.64,30.33 IC19.31 | v47.62,30.33 IC19.42 | IC19.7 v47.62,23.98 | IC19.18 v40.64,23.98
  Bottom 0.406: IC14.15 137.74,66.52 | IC1.31 31.8,76.73 C1.1 | IC3.31 90.92,76.79 C5.1 | 60.96,76.68 IC2.31
  Bottom 0.61: IC14.16 136.53,64.25 C16.1
  Bottom 0.813: C2.1 C1.1 | C4.1 C3.1 | C6.1 C5.1
  other vias: 137.73,43.47 137.79,62.59 137.67,21.69 144.78,67.79
  pour Bottom (isolate 0.305, rank 2, no thermals): 136.37,68.11 138.11,68.11 138.11,62.33 136.37,62.33
  pour Bottom (isolate 0.305, rank 2, no thermals): 136.37,25.57 138.05,25.57 138.05,21.31 136.37,21.31
  pour Bottom (isolate 0.305, rank 2, no thermals): 136.21,46.52 137.95,46.52 137.95,44.77 138.11,44.62 138.11,42.27 136.21,42.27
  pour Top (isolate 0.305, rank 6): 0,100.18 0,-0.15 160.66,-0.15 160.66,100.18
  pour Top (isolate 0.305, no thermals): 148.75,85.41 155.89,85.41 155.89,83.19 148.75,83.19
  pour Top (isolate 0.305, no thermals): 148.75,11.75 155.89,11.75 155.89,9.53 148.75,9.53
  pour Bottom (isolate 0.254): 149.86,66.52 149.86,65.25 145.41,65.25 144.15,66.52 135.25,66.52 135.25,68.43 135.89,69.06 147.32,69.06
WUNIT0  (via drill 0.3)
  Top 0.254: P1.29 21.59,53.82 22.86,52.55 v25.4,52.55 v33.02,52.55
  Bottom 0.254: v33.02,52.55 33.02,63.35 31.75,64.62 IC1.18 | IC18.36 27.3,36.04 25.4,37.95 v25.4,52.55
WUNIT1  (via drill 0.3)
  Top 0.254: P1.31 13.97,56.36 14.61,55.73 22.23,55.73 24.13,53.82 v25.4,53.82 v33.66,53.82
  Bottom 0.254: v33.66,53.82 33.66,63.98 33.02,64.62 33.02,67.79 IC1.19 | IC18.35 26.67,35.41 24.77,37.31 24.77,53.19 v25.4,53.82
WUNIT2  (via drill 0.3)
  Top 0.254: P1.33 13.97,58.9 15.88,57 v23.5,57 25.4,55.09 v34.29,55.09
  Bottom 0.254: v23.5,57 23.5,36.68 25.4,34.77 IC18.33 | v34.29,55.09 IC1.20

## Text on the board
tNames: CFT Minicomputer Processor Board 0 (Sequencer) Rev C | (c) 2013 AlexiosC | µPC | PB0 | µCB | To PB1 | microcode-00 | microcode-01 | microcode-02 | 00 | 01 | 02 | µCB | Use Microcode v4+ ROM images | IC7-13: Optional (µCB Extension) | Bridge SJ1-4 if NOT installed. | Bus Termination | µCB | http://www.bedroomlan.org/cft
bNames: Bridge SJ1-4 if µCB Extension NOT installed. | (c) 2013 AlexiosC | http://www.bedroomlan.org/cft | PB0 | Bus Termination | Front Panel Buffers | CFT | To Processor Board 1 | To Front Panel | CFT Minicomputer Processor Board 0 (Sequencer) Rev C